# Altium schematic sheet LDO_3v3_LM2937.SchDoc: 3v3 LDO Module
size A4; Author: Nikola Raševiæ; Organization: Memristor Robotics; SheetNumber: 2; SheetTotal: 11
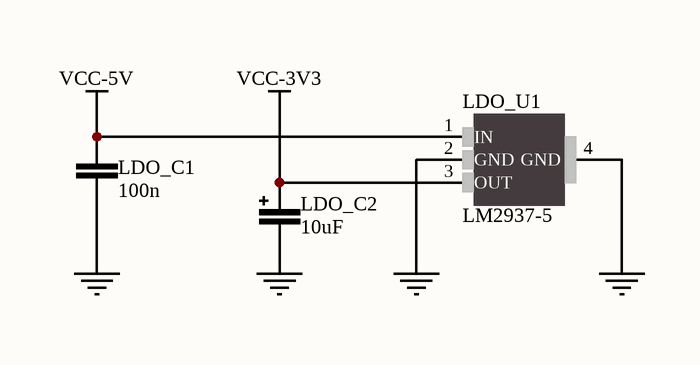
[diagram p0: LDO_3v3_LM2937.SchDoc]

## Parts
LDO_C1  100n  [CER_0603]
LDO_C2  10uF  [TANT_1210]
LDO_U1  LM2937-5  [SOT223]

## Nets
GND: LDO_C1.1 LDO_C2.2 LDO_U1.2(GND) LDO_U1.4(GND)
VCC-3V3: LDO_C2.1 LDO_U1.3(OUT)
VCC-5V: LDO_C1.2 LDO_U1.1(IN)

## Notes on the sheet
- Title
- Date:
- Design Engineer:
- Time:
- Revision:
- Sheet
- of
- Size:
- A4
- www.memristor-robotics.io
- File:

## Library data of the parts
LDO_C1 = 06032105: CAP CER 100n 10V X5R 10% 0603; Capacitance: 100n
LDO_C2 = 00001106: CAP TANT 10u; Value: 10uF
LDO_U1 = LM2937: IC REG LINEAR 5V 400MA SOT223-4; Manufacturer Part Number: LM2937-5; Datasheet Link: http://www.ti.com/lit/ds/symlink/lm2937.pdf